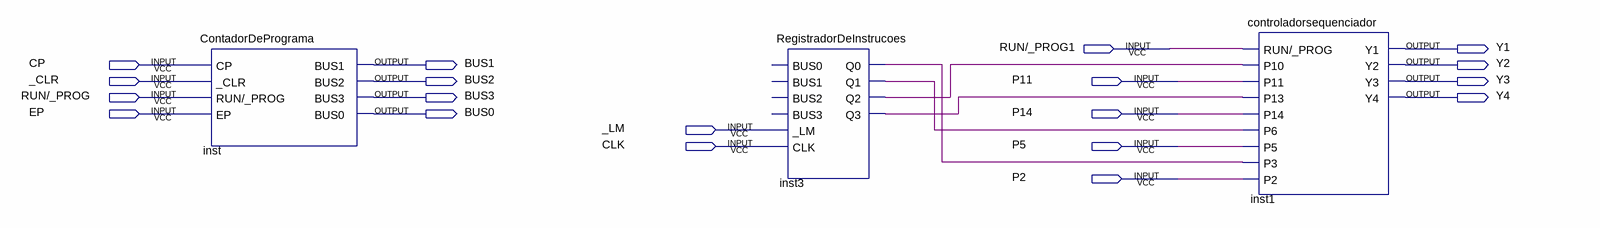
[diagram p0: schematic sheet]
// Quartus schematic UnidadeDeControle.bdf as structural Verilog: 3 symbols, 19 pins
module UnidadeDeControle (
  input  \RUN/_PROG1 ,
  input  CP,
  input  _CLR,
  input  P11,
  input  \RUN/_PROG ,
  input  EP,
  input  P14,
  input  _LM,
  input  CLK,
  input  P5,
  input  P2,
  output Y1,
  output BUS1,
  output Y2,
  output BUS2,
  output Y3,
  output BUS3,
  output Y4,
  output BUS0
);

  wire inst3_q0, inst3_q1, inst3_q2, inst3_q3;

  ContadorDePrograma inst (
    .CP(CP), ._CLR(_CLR), .\RUN/_PROG (\RUN/_PROG ), .EP(EP), .BUS1(BUS1), .BUS2(BUS2), .BUS3(BUS3),
    .BUS0(BUS0));
  RegistradorDeInstrucoes inst3 (
    ._LM(_LM), .CLK(CLK), .Q0(inst3_q0), .Q1(inst3_q1), .Q2(inst3_q2), .Q3(inst3_q3));  // open: BUS0, BUS1, BUS2, BUS3
  controladorsequenciador inst1 (
    .\RUN/_PROG (\RUN/_PROG1 ), .P10(inst3_q2), .P11(P11), .P13(inst3_q3), .P14(P14), .P6(inst3_q1), .P5(P5),
    .P3(inst3_q0), .P2(P2), .Y1(Y1), .Y2(Y2), .Y3(Y3), .Y4(Y4));
endmodule
